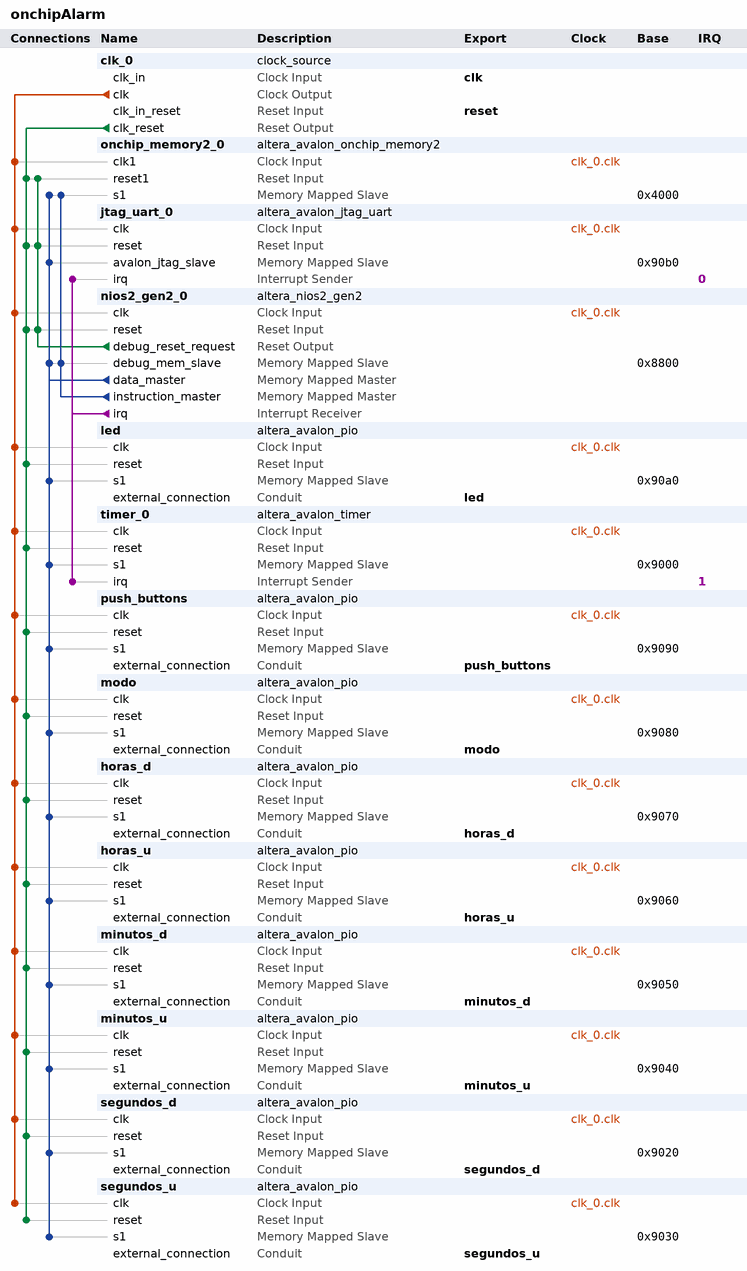
[diagram p0: system contents]
# Platform Designer (Qsys) system onchipAlarm, Cyclone V 5CSEMA5F31C6
# Parameters at their usual value, and those the tool derives, are not listed.
package require -exact qsys 16.1
create_system onchipAlarm
set_project_property DEVICE_FAMILY {Cyclone V}
set_project_property DEVICE 5CSEMA5F31C6

add_instance clk_0 clock_source 16.1
set_instance_parameter_value clk_0 clockFrequency 50000000

add_instance onchip_memory2_0 altera_avalon_onchip_memory2 16.1
set_instance_parameter_value onchip_memory2_0 dataWidth 32
set_instance_parameter_value onchip_memory2_0 dualPort false
set_instance_parameter_value onchip_memory2_0 initMemContent true
set_instance_parameter_value onchip_memory2_0 initializationFileName onchip_mem.hex
set_instance_parameter_value onchip_memory2_0 memorySize 16384

add_instance jtag_uart_0 altera_avalon_jtag_uart 16.1
set_instance_parameter_value jtag_uart_0 simInteractiveOptions NO_INTERACTIVE_WINDOWS

add_instance nios2_gen2_0 altera_nios2_gen2 16.1
set_instance_parameter_value nios2_gen2_0 dcache_size 2048
set_instance_parameter_value nios2_gen2_0 exceptionSlave onchip_memory2_0.s1
set_instance_parameter_value nios2_gen2_0 icache_size 4096
set_instance_parameter_value nios2_gen2_0 impl Tiny
set_instance_parameter_value nios2_gen2_0 resetSlave onchip_memory2_0.s1

add_instance led altera_avalon_pio 16.1
set_instance_parameter_value led direction Output
set_instance_parameter_value led width 1

add_instance timer_0 altera_avalon_timer 16.1
set_instance_parameter_value timer_0 period 1
set_instance_parameter_value timer_0 periodUnits MSEC

add_instance push_buttons altera_avalon_pio 16.1
set_instance_parameter_value push_buttons direction Input
set_instance_parameter_value push_buttons width 4

add_instance modo altera_avalon_pio 16.1
set_instance_parameter_value modo direction Input
set_instance_parameter_value modo width 1

add_instance horas_d altera_avalon_pio 16.1
set_instance_parameter_value horas_d direction Output
set_instance_parameter_value horas_d width 7

add_instance horas_u altera_avalon_pio 16.1
set_instance_parameter_value horas_u direction Output
set_instance_parameter_value horas_u width 7

add_instance minutos_d altera_avalon_pio 16.1
set_instance_parameter_value minutos_d direction Output
set_instance_parameter_value minutos_d width 7

add_instance minutos_u altera_avalon_pio 16.1
set_instance_parameter_value minutos_u direction Output
set_instance_parameter_value minutos_u width 7

add_instance segundos_d altera_avalon_pio 16.1
set_instance_parameter_value segundos_d direction Output
set_instance_parameter_value segundos_d width 7

add_instance segundos_u altera_avalon_pio 16.1
set_instance_parameter_value segundos_u direction Output
set_instance_parameter_value segundos_u width 7

# connections
add_connection clk_0.clk horas_d.clk clock
add_connection clk_0.clk horas_u.clk clock
add_connection clk_0.clk jtag_uart_0.clk clock
add_connection clk_0.clk led.clk clock
add_connection clk_0.clk minutos_d.clk clock
add_connection clk_0.clk minutos_u.clk clock
add_connection clk_0.clk modo.clk clock
add_connection clk_0.clk nios2_gen2_0.clk clock
add_connection clk_0.clk onchip_memory2_0.clk1 clock
add_connection clk_0.clk push_buttons.clk clock
add_connection clk_0.clk segundos_d.clk clock
add_connection clk_0.clk segundos_u.clk clock
add_connection clk_0.clk timer_0.clk clock
add_connection clk_0.clk_reset horas_d.reset reset
add_connection clk_0.clk_reset horas_u.reset reset
add_connection clk_0.clk_reset jtag_uart_0.reset reset
add_connection clk_0.clk_reset led.reset reset
add_connection clk_0.clk_reset minutos_d.reset reset
add_connection clk_0.clk_reset minutos_u.reset reset
add_connection clk_0.clk_reset modo.reset reset
add_connection clk_0.clk_reset nios2_gen2_0.reset reset
add_connection clk_0.clk_reset onchip_memory2_0.reset1 reset
add_connection clk_0.clk_reset push_buttons.reset reset
add_connection clk_0.clk_reset segundos_d.reset reset
add_connection clk_0.clk_reset segundos_u.reset reset
add_connection clk_0.clk_reset timer_0.reset reset
add_connection nios2_gen2_0.debug_reset_request jtag_uart_0.reset reset
add_connection nios2_gen2_0.debug_reset_request nios2_gen2_0.reset reset
add_connection nios2_gen2_0.debug_reset_request onchip_memory2_0.reset1 reset
add_connection nios2_gen2_0.data_master horas_d.s1 avalon
set_connection_parameter_value nios2_gen2_0.data_master/horas_d.s1 baseAddress 0x9070
add_connection nios2_gen2_0.data_master horas_u.s1 avalon
set_connection_parameter_value nios2_gen2_0.data_master/horas_u.s1 baseAddress 0x9060
add_connection nios2_gen2_0.data_master jtag_uart_0.avalon_jtag_slave avalon
set_connection_parameter_value nios2_gen2_0.data_master/jtag_uart_0.avalon_jtag_slave baseAddress 0x90b0
add_connection nios2_gen2_0.data_master led.s1 avalon
set_connection_parameter_value nios2_gen2_0.data_master/led.s1 baseAddress 0x90a0
add_connection nios2_gen2_0.data_master minutos_d.s1 avalon
set_connection_parameter_value nios2_gen2_0.data_master/minutos_d.s1 baseAddress 0x9050
add_connection nios2_gen2_0.data_master minutos_u.s1 avalon
set_connection_parameter_value nios2_gen2_0.data_master/minutos_u.s1 baseAddress 0x9040
add_connection nios2_gen2_0.data_master modo.s1 avalon
set_connection_parameter_value nios2_gen2_0.data_master/modo.s1 baseAddress 0x9080
add_connection nios2_gen2_0.data_master nios2_gen2_0.debug_mem_slave avalon
set_connection_parameter_value nios2_gen2_0.data_master/nios2_gen2_0.debug_mem_slave baseAddress 0x8800
add_connection nios2_gen2_0.data_master onchip_memory2_0.s1 avalon
set_connection_parameter_value nios2_gen2_0.data_master/onchip_memory2_0.s1 baseAddress 0x4000
add_connection nios2_gen2_0.data_master push_buttons.s1 avalon
set_connection_parameter_value nios2_gen2_0.data_master/push_buttons.s1 baseAddress 0x9090
add_connection nios2_gen2_0.data_master segundos_d.s1 avalon
set_connection_parameter_value nios2_gen2_0.data_master/segundos_d.s1 baseAddress 0x9020
add_connection nios2_gen2_0.data_master segundos_u.s1 avalon
set_connection_parameter_value nios2_gen2_0.data_master/segundos_u.s1 baseAddress 0x9030
add_connection nios2_gen2_0.data_master timer_0.s1 avalon
set_connection_parameter_value nios2_gen2_0.data_master/timer_0.s1 baseAddress 0x9000
add_connection nios2_gen2_0.instruction_master nios2_gen2_0.debug_mem_slave avalon
set_connection_parameter_value nios2_gen2_0.instruction_master/nios2_gen2_0.debug_mem_slave baseAddress 0x8800
add_connection nios2_gen2_0.instruction_master onchip_memory2_0.s1 avalon
set_connection_parameter_value nios2_gen2_0.instruction_master/onchip_memory2_0.s1 baseAddress 0x4000
add_connection nios2_gen2_0.irq jtag_uart_0.irq interrupt
set_connection_parameter_value nios2_gen2_0.irq/jtag_uart_0.irq irqNumber 0
add_connection nios2_gen2_0.irq timer_0.irq interrupt
set_connection_parameter_value nios2_gen2_0.irq/timer_0.irq irqNumber 1

# exported interfaces
add_interface clk clock sink
set_interface_property clk EXPORT_OF clk_0.clk_in
add_interface horas_d conduit end
set_interface_property horas_d EXPORT_OF horas_d.external_connection
add_interface horas_u conduit end
set_interface_property horas_u EXPORT_OF horas_u.external_connection
add_interface led conduit end
set_interface_property led EXPORT_OF led.external_connection
add_interface minutos_d conduit end
set_interface_property minutos_d EXPORT_OF minutos_d.external_connection
add_interface minutos_u conduit end
set_interface_property minutos_u EXPORT_OF minutos_u.external_connection
add_interface modo conduit end
set_interface_property modo EXPORT_OF modo.external_connection
add_interface push_buttons conduit end
set_interface_property push_buttons EXPORT_OF push_buttons.external_connection
add_interface reset reset sink
set_interface_property reset EXPORT_OF clk_0.clk_in_reset
add_interface segundos_d conduit end
set_interface_property segundos_d EXPORT_OF segundos_d.external_connection
add_interface segundos_u conduit end
set_interface_property segundos_u EXPORT_OF segundos_u.external_connection

set_interconnect_requirement {$system} qsys_mm.clockCrossingAdapter HANDSHAKE
set_interconnect_requirement {$system} qsys_mm.enableEccProtection FALSE
set_interconnect_requirement {$system} qsys_mm.insertDefaultSlave FALSE
set_interconnect_requirement {$system} qsys_mm.maxAdditionalLatency 1

save_system onchipAlarm.qsys
